# Altium schematic sheet RAM_Module.SchDoc
size A3; SheetNumber: 6; SheetTotal: 9
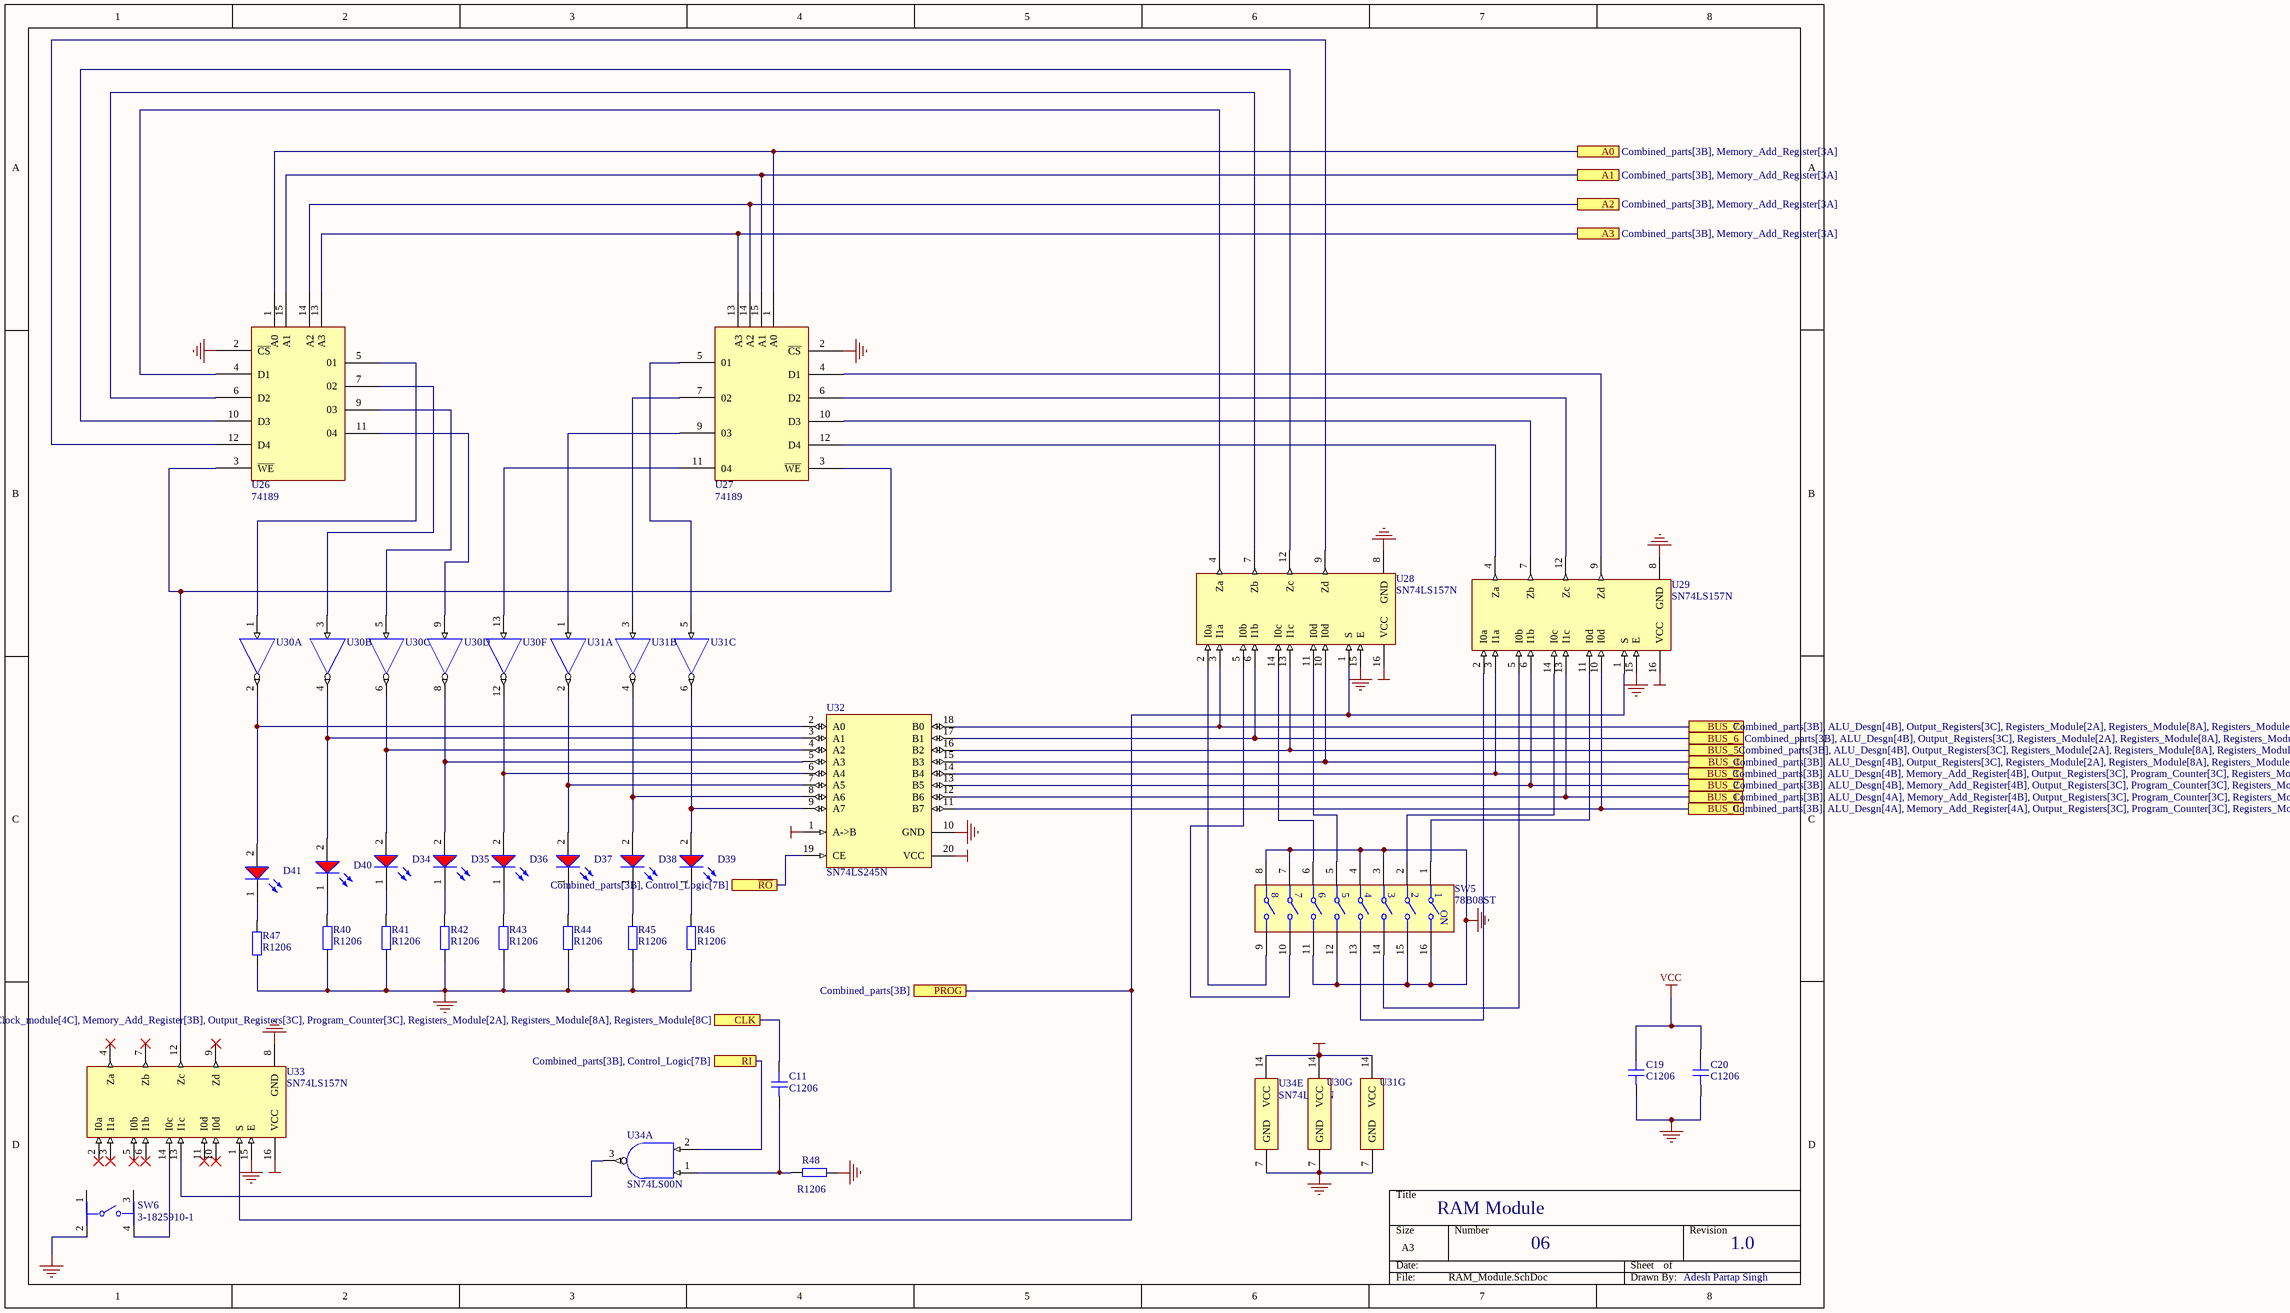
[diagram p0: RAM_Module.SchDoc]

## Parts
C11  C1206  [CAP_1206]
C19  C1206  [CAP_1206]
C20  C1206  [CAP_1206]
D34  151053RS03000  [WL-TMRW_D5.8H11.7]  (value not drawn)
D35  151053RS03000  [WL-TMRW_D5.8H11.7]  (value not drawn)
D36  151053RS03000  [WL-TMRW_D5.8H11.7]  (value not drawn)
D37  151053RS03000  [WL-TMRW_D5.8H11.7]  (value not drawn)
D38  151053RS03000  [WL-TMRW_D5.8H11.7]  (value not drawn)
D39  151053RS03000  [WL-TMRW_D5.8H11.7]  (value not drawn)
D40  151053RS03000  [WL-TMRW_D5.8H11.7]  (value not drawn)
D41  151053RS03000  [WL-TMRW_D5.8H11.7]  (value not drawn)
R40  R1206  [RES_1206]
R41  R1206  [RES_1206]
R42  R1206  [RES_1206]
R43  R1206  [RES_1206]
R44  R1206  [RES_1206]
R45  R1206  [RES_1206]
R46  R1206  [RES_1206]
R47  R1206  [RES_1206]
R48  R1206  [RES_1206]
SW5  78B08ST  [FP-78B08ST-MFG]
SW6  3-1825910-1  [FP-3-1825910-1-MFG]
U26  74189  [N0016A]
U27  74189  [N0016A]
U28  SN74LS157N  [N0016A]
U29  SN74LS157N  [N0016A]
U30  SN74LS04NSR  [NS0014A_M]  (value not drawn)  (parts A,B,C,D,F,G of 7)
U31  SN74LS04NSR  [NS0014A_M]  (value not drawn)  (parts A,B,C,G of 7)
U32  SN74LS245N  [FP-N0020A-MFG]
U33  SN74LS157N  [N0016A]
U34  SN74LS00N  [N0014A]  (parts A,E of 5)

## Ports
A0 (see Combined_parts[3B], Memory_Add_Register[3A]), A1 (see Combined_parts[3B], Memory_Add_Register[3A]), A2 (see Combined_parts[3B], Memory_Add_Register[3A]), A3 (see Combined_parts[3B], Memory_Add_Register[3A]), BUS_0 (see Combined_parts[3B], ALU_Desgn[4A], Memory_Add_Register[4A], Output_Registers[3C], Program_Counter[3C], Registers_Module[2A], Registers_Module[8A], Registers_Module[8C]), BUS_1 (see Combined_parts[3B], ALU_Desgn[4A], Memory_Add_Register[4B], Output_Registers[3C], Program_Counter[3C], Registers_Module[2A], Registers_Module[8A], Registers_Module[8C]), BUS_2 (see Combined_parts[3B], ALU_Desgn[4B], Memory_Add_Register[4B], Output_Registers[3C], Program_Counter[3C], Registers_Module[2A], Registers_Module[8A], Registers_Module[8C]), BUS_3 (see Combined_parts[3B], ALU_Desgn[4B], Memory_Add_Register[4B], Output_Registers[3C], Program_Counter[3C], Registers_Module[2A], Registers_Module[8A], Registers_Module[8C]), BUS_4 (see Combined_parts[3B], ALU_Desgn[4B], Output_Registers[3C], Registers_Module[2A], Registers_Module[8A], Registers_Module[8C]), BUS_5 (see Combined_parts[3B], ALU_Desgn[4B], Output_Registers[3C], Registers_Module[2A], Registers_Module[8A], Registers_Module[8C]), BUS_6 (see Combined_parts[3B], ALU_Desgn[4B], Output_Registers[3C], Registers_Module[2A], Registers_Module[8A], Registers_Module[8C]), BUS_7 (see Combined_parts[3B], ALU_Desgn[4B], Output_Registers[3C], Registers_Module[2A], Registers_Module[8A], Registers_Module[8C]), CLK (see Combined_parts[3B], ALU_Desgn[3C], Clock_module[4C], Memory_Add_Register[3B], Output_Registers[3C], Program_Counter[3C], Registers_Module[2A], Registers_Module[8A], Registers_Module[8C]), PROG (see Combined_parts[3B]), RI (see Combined_parts[3B], Control_Logic[7B]), ~{RO} (see Combined_parts[3B], Control_Logic[7B])

## Nets
GND: C19.1 C20.1 R40.1 R41.1 R42.1 R43.1 R44.1 R45.1 R46.1 R47.1 R48.1 SW5.3 SW5.4 SW5.7 SW5.8 SW5.11 SW5.12 SW5.15 SW5.16 SW6.2 U26.2(~{CS}) U27.2(~{CS}) U28.8(GND) U28.15(E) U29.8(GND) U29.15(E) U30.7(GND) U31.7(GND) U32.10(GND) U33.8(GND) U33.15(E) U34.7(GND)
VCC: C19.2 C20.2 U28.16(VCC) U29.16(VCC) U30.14(VCC) U31.14(VCC) U32.1(A->B) U32.20(VCC) U33.16(VCC) U34.14(VCC)
A0: U26.1(A0) U27.1(A0) ; port A0
A1: U26.15(A1) U27.15(A1) ; port A1
A2: U26.14(A2) U27.14(A2) ; port A2
A3: U26.13(A3) U27.13(A3) ; port A3
BUS_0: U29.10(I0d) U32.11(B7) ; port BUS_0
BUS_1: U29.13(I1c) U32.12(B6) ; port BUS_1
BUS_2: U29.6(I1b) U32.13(B5) ; port BUS_2
BUS_3: U29.3(I1a) U32.14(B4) ; port BUS_3
BUS_4: U28.10(I0d) U32.15(B3) ; port BUS_4
BUS_5: U28.13(I1c) U32.16(B2) ; port BUS_5
BUS_6: U28.6(I1b) U32.17(B1) ; port BUS_6
BUS_7: U28.3(I1a) U32.18(B0) ; port BUS_7
CLK: C11.2 ; port CLK
PROG: U28.1(S) U29.1(S) U33.1(S) ; port PROG
~{RO}: U32.19(CE) ; port ~{RO}
RI: U34.2(1B) ; port RI
NetC11_1: C11.1 R48.2 U34.1(1A)
NetD34_1: D34.1(K) R41.2
NetD34_2: D34.2(A) U30.6(~{3Y}) U32.4(A2)
NetD35_1: D35.1(K) R42.2
NetD35_2: D35.2(A) U30.8(~{4Y}) U32.5(A3)
NetD36_1: D36.1(K) R43.2
NetD36_2: D36.2(A) U30.12(~{6Y}) U32.6(A4)
NetD37_1: D37.1(K) R44.2
NetD37_2: D37.2(A) U31.2(~{1Y}) U32.7(A5)
NetD38_1: D38.1(K) R45.2
NetD38_2: D38.2(A) U31.4(~{2Y}) U32.8(A6)
NetD39_1: D39.1(K) R46.2
NetD39_2: D39.2(A) U31.6(~{3Y}) U32.9(A7)
NetD40_1: D40.1(K) R40.2
NetD40_2: D40.2(A) U30.4(~{2Y}) U32.3(A1)
NetD41_1: D41.1(K) R47.2
NetD41_2: D41.2(A) U30.2(~{1Y}) U32.2(A0)
NetSW5_1: SW5.1 U29.11(I0d)
NetSW5_2: SW5.2 U29.14(I0c)
NetSW5_5: SW5.5 U28.11(I0d)
NetSW5_6: SW5.6 U28.14(I0c)
NetSW5_9: SW5.9 U28.2(I0a)
NetSW5_10: SW5.10 U28.5(I0b)
NetSW5_13: SW5.13 U29.2(I0a)
NetSW5_14: SW5.14 U29.5(I0b)
NetSW6_4: SW6.4 U33.14(I0c)
NetU26_3: U26.3(~{WE}) U27.3(~{WE}) U33.12(Zc)
NetU26_4: U26.4(D1) U28.4(Za)
NetU26_5: U26.5(01) U30.1(1A)
NetU26_6: U26.6(D2) U28.7(Zb)
NetU26_7: U26.7(02) U30.3(2A)
NetU26_9: U26.9(03) U30.5(3A)
NetU26_10: U26.10(D3) U28.12(Zc)
NetU26_11: U26.11(04) U30.9(4A)
NetU26_12: U26.12(D4) U28.9(Zd)
NetU27_4: U27.4(D1) U29.9(Zd)
NetU27_5: U27.5(01) U31.5(3A)
NetU27_6: U27.6(D2) U29.12(Zc)
NetU27_7: U27.7(02) U31.3(2A)
NetU27_9: U27.9(03) U31.1(1A)
NetU27_10: U27.10(D3) U29.7(Zb)
NetU27_11: U27.11(04) U30.13(6A)
NetU27_12: U27.12(D4) U29.4(Za)
NetU33_13: U33.13(I1c) U34.3(1Y)

Not connected (* = marked no-connect by the designer): SW6 1 3; U33 2(I0a)* 3(I1a)* 4(Za)* 5(I0b)* 6(I1b)* 7(Zb)* 9(Zd)* 10(I0d)* 11(I0d)*

## Notes on the sheet
- RAM Module
- 06
- 1.0
- Adesh Partap Singh
- (in symbol CMP-31942-000004-2) ON

## Library data of the parts
C11 C19 C20 = CAP_1206: Capacitor SMD 1206; Manufacturer: *; Manufacturer Part Number: *; Distributor Link: *; LCSC: *; Rating: *; Dielectric: *
D34-D41 = CMP-1489-00007-2: NexarPartId: 29717818; Viewing Angle: 30°; Test Current: 20mA; Forward Voltage: 1.9V; Lens Size: 5mm; Wavelength: 623nm; Lens Style: Circular, Clear, Round; Luminous Intensity: 5cd; Peak Wavelength: 631nm; Max Reverse Voltage (DC): 5V; Forward Current: 100mA; Color: Red; Height: 8.6mm; Packaging: Bulk; Length: 5mm; Dominant Wavelength: 623nm; RoHS: Compliant; Mount: Through Hole; Max Operating Temperature: 85°C; Width: 5mm; Case/Package: Radial; Min Operating Temperature: -40°C; REACH SVHC: Unknown
R40-R48 = RES_1206: Resistor SMD 1206; Manufacturer: *; Manufacturer Part Number: *; Distributor Link: *; LCSC: *
SW5 = CMP-31942-000004-2: SWITCH SLIDE DIP SPST 150MA 30V; Electrical Life: 2000Cycles; Number of Switches: 8; Pitch: 0.1inch; Lead Length: 2.54mm; Actuator Type: Slide (Standard); Washable: Yes; Actuator Length: 1.27mm; Body Material: Thermoplastic; Insulation Resistance: 5GR; Contact Current Rating: 25mA; Contact Resistance: 30mR; Number of Positions: 8; Number of Circuits: 8; Mount: Through Hole; Depth: 9.65mm; Max Operating Temperature: 85°C; Max Voltage Rating (DC): 30V; Current Rating: 150mA; Voltage Rating (DC): 30V; Throw Configuration: SPST; Series: 78; Material: Thermoplastic; REACH SVHC: No SVHC; Contact Material: Copper Alloy; Orientation: Straight; Contact Plating: Gold; Max Current Rating: 150mA; Mechanical Life: 2000Cycles; Min Operating Temperature: -40°C; Radiation Hardening: No; Termination: PC Pins; Length: 22.4mm; RoHS Compliant: Yes; Packaging: Rail/Tube; Terminal Pitch: 2.54mm; Voltage Rating: 30V; Lead Free: Lead Free
SW6 = CMP-03407-000001-1: SWITCH TACTILE SPST-NO 0.05A 24V; Manufacturer: TE Connectivity; Operating Force: 160gf; Contact Current Rating: 50mA; Contact Resistance: 100mΩ; Electromechanical Life: 100000Cycles; Device Class L1: Electromechanical; ComponentLink2URL: https://www.te.com/commerce/DocumentDelivery/DDEController?Action=srchrtrv&DocNm=1825910&DocType=Customer+Drawing&DocLang=English; Category: Switch; Device Class L2: Switches; Temperature: -35°C to +85°C; RoHS: TRUE; Mount: Through Hole; Manufacturer Part Number: 3-1825910-1; Automotive: No; Lead Free: Yes; Device Class L3: Tactile Switches; ComponentLink2Description: Datasheet; Temperature Range High: +85°C; Height: 17.3mm; Package: 0; Temperature Range Low: -35°C; Throw Configuration: SPST-NO; Digikey Description: SWITCH TACTILE SPST-NO 0.05A 24V; Octopart: https://octopart.com/3-1825910-1-te+connectivity-46506874
U26 = 64 BIT RAM: RAM; Manufacturer: Texas Instruments; Generic Part Number: SN74LS157; Configuration: 2：1; Voltage(Nom)(V): 5; ICC @ Nom Voltage(Max)(mA): 16; VCC(Min)(V): 4.75; Channels(#): 4; Rating: Military; tpd @ Nom Voltage(Max)(ns): 14; F @ Nom Voltage(Max)(Mhz): 35; Technology Family: LS; Output Drive (IOL/IOH)(Max)(mA): 8/-0.4; Function: Encoder/Multiplexer; Schmitt Trigger: No; VCC(Max)(V): 5.25; DatasheetVersion: SDLS058; Code_JEDEC: MS-001; Operating Temperature Range(C): 0 to 70; Type: Standard; PackageReference: N0016A
U27 = 64 BIT RAM_2: RAM; Manufacturer: Texas Instruments; Generic Part Number: SN74LS157; Configuration: 2：1; Voltage(Nom)(V): 5; ICC @ Nom Voltage(Max)(mA): 16; VCC(Min)(V): 4.75; Channels(#): 4; Rating: Military; tpd @ Nom Voltage(Max)(ns): 14; F @ Nom Voltage(Max)(Mhz): 35; Technology Family: LS; Output Drive (IOL/IOH)(Max)(mA): 8/-0.4; Function: Encoder/Multiplexer; Schmitt Trigger: No; VCC(Max)(V): 5.25; DatasheetVersion: SDLS058; Code_JEDEC: MS-001; Operating Temperature Range(C): 0 to 70; Type: Standard; PackageReference: N0016A
U28 U29 U33 = CMP-1633-00683-2: Quadruple 2-Line To 1-Line Data Selectors/Multiplexers, N0016A, TUBE; Manufacturer: Texas Instruments; Configuration: 2：1; Voltage(Nom)(V): 5; ICC @ Nom Voltage(Max)(mA): 16; VCC(Min)(V): 4.75; Channels(#): 4; Rating: Military; tpd @ Nom Voltage(Max)(ns): 14; F @ Nom Voltage(Max)(Mhz): 35; Technology Family: LS; Output Drive (IOL/IOH)(Max)(mA): 8/-0.4; Function: Encoder/Multiplexer; Schmitt Trigger: No; VCC(Max)(V): 5.25; Generic Part Number: SN74LS157; DatasheetVersion: SDLS058; Code_JEDEC: MS-001; Operating Temperature Range(C): 0 to 70; Type: Standard; PackageReference: N0016A
U30 U31 = CMP-1615-00958-3: Hex inverters, NS0014A, LARGE T&R; Manufacturer: Texas Instruments; VCC(Min)(V): 4.75; ICC @ Nom Voltage(Max)(mA): 0.033; tpd @ Nom Voltage(Max)(ns): 22; Rating: Catalog; F @ Nom Voltage(Max)(Mhz): 35; Voltage(Nom)(V): 5; VCC(Max)(V): 5.25; Output Drive (IOL/IOH)(Max)(mA): -0.4/8; Output Type: CMOS; Schmitt Trigger: No; Input Type: TTL; Technology Family: LS; Bits(#): 6; Operating Temperature Range(C): 0 to 70; DatasheetVersion: SDLS029C; Generic Part Number: SN74LS04; PackageReference: NS0014A
U32 = CMP-1620-00419-3: IC TXRX NON-INVERT 5.25V 20DIP; Number of Bits per Element: 8; Polarity: Non-Inverting; Low Level Output Current: 24mA; Propagation Delay: 12ns; Min Supply Voltage: 4.75V; Number of Elements: 1; Quiescent Current: 62mA; Logic Function: Transceiver; Direction: Bidirectional; Operating Supply Voltage: 5V; High Level Output Current: -15mA; Mount: Through Hole; Min Operating Temperature: 0°C; Number of Outputs: 8; Max Operating Temperature: 70°C; Max Supply Voltage: 5.25V; Width: 6.35mm; Number of Pins: 20; RoHS Compliant: Yes; Turn-On Delay Time: 12ns; Termination: Through Hole; Number of Channels: 8; Number of Circuits: 8; Weight: 0.042297oz; Package Quantity: 20; Number of Transceivers: 8; Length: 24.33mm; Height: 4.57mm; REACH SVHC: No SVHC; Contact Plating: Gold; Number of Bits: 8; Lead Free: Lead Free; Case/Package: PDIP; Packaging: Rail/Tube; Radiation Hardening: No
U34 = CMP-1627-00476-2: Quad 2-input positive-NAND gates, N0014A, TUBE; Manufacturer: Texas Instruments; VCC(Min)(V): 4.75; F @ Nom Voltage(Max)(Mhz): 35; Voltage(Nom)(V): 5; Rating: Catalog; tpd @ Nom Voltage(Max)(ns): 22; Output Type: TTL; Schmitt Trigger: No; Output Drive (IOL/IOH)(Max)(mA): 0.4/-16; Technology Family: LS; ICC @ Nom Voltage(Max)(mA): 0.022; VCC(Max)(V): 5.25; Bits(#): 4; Code_JEDEC: MS-001; Generic Part Number: SN74LS00; Input Type: TTL; Operating Temperature Range(C): 0 to 70; PackageReference: N0014A; DatasheetVersion: SDLS025B